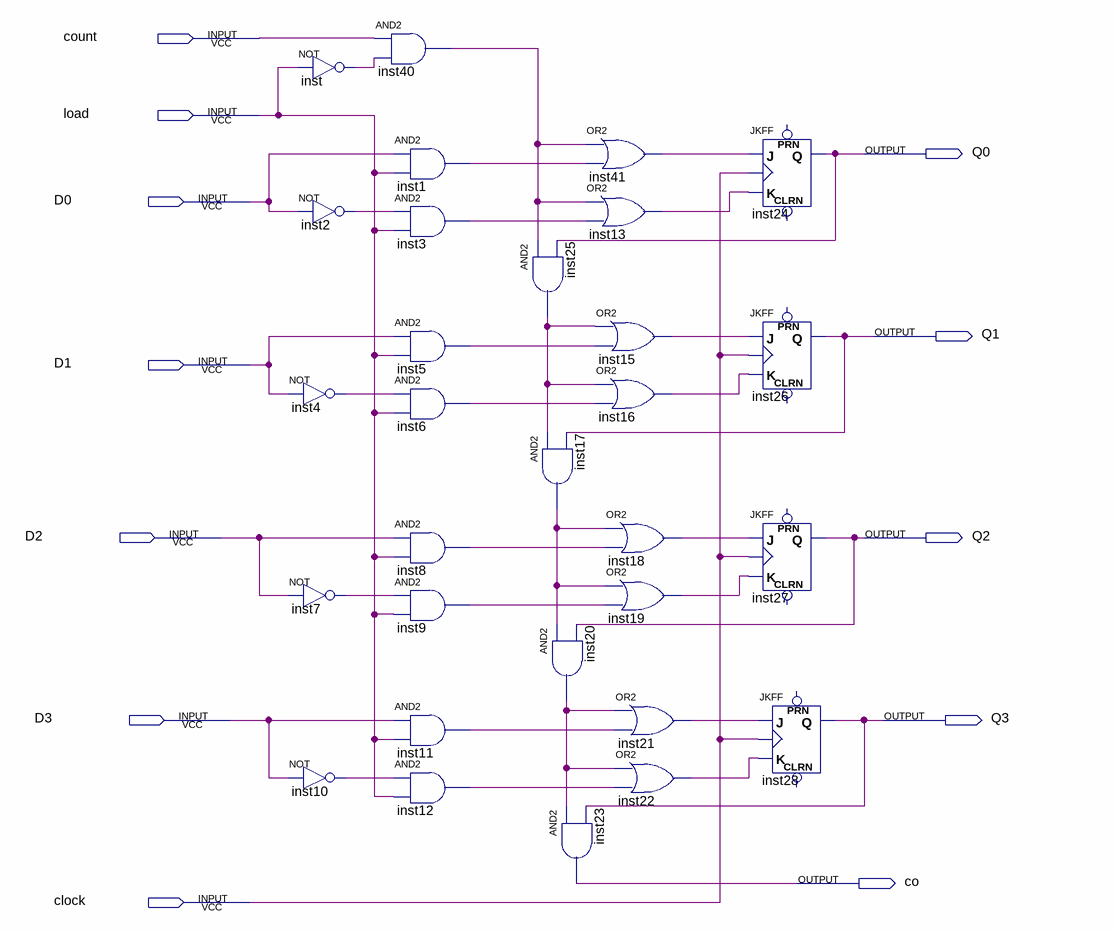
[diagram p0: schematic sheet]
// Quartus schematic yusuf_gassaloglu_2020510034_HW1_a.bdf as structural Verilog: 30 symbols, 12 pins
module yusuf_gassaloglu_2020510034_HW1_a (
  input  count,
  input  load,
  input  D0,
  input  D1,
  input  D2,
  input  D3,
  input  clock,
  output Q0,
  output Q1,
  output Q2,
  output Q3,
  output co
);

  wire inst1_out, inst2_out, inst3_out, inst4_out, inst5_out, inst6_out, inst7_out, inst8_out, inst9_out,
       inst10_out, inst11_out, inst12_out, inst13_out, inst15_out, inst16_out, inst17_out, inst18_out,
       inst19_out, inst20_out, inst21_out, inst22_out, inst25_out, inst40_out, inst41_out, inst_out;

  not inst (inst_out, load);
  not inst2 (inst2_out, D0);
  not inst4 (inst4_out, D1);
  not inst7 (inst7_out, D2);
  not inst10 (inst10_out, D3);
  and inst40 (inst40_out, count, inst_out);
  and inst1 (inst1_out, D0, load);
  and inst3 (inst3_out, inst2_out, load);
  and inst5 (inst5_out, D1, load);
  and inst6 (inst6_out, inst4_out, load);
  and inst8 (inst8_out, D2, load);
  and inst9 (inst9_out, inst7_out, load);
  and inst11 (inst11_out, D3, load);
  and inst12 (inst12_out, inst10_out, load);
  and inst25 (inst25_out, inst40_out, Q0);
  and inst17 (inst17_out, inst25_out, Q1);
  or inst41 (inst41_out, inst40_out, inst1_out);
  or inst13 (inst13_out, inst40_out, inst3_out);
  or inst15 (inst15_out, inst25_out, inst5_out);
  or inst16 (inst16_out, inst25_out, inst6_out);
  or inst18 (inst18_out, inst17_out, inst8_out);
  or inst19 (inst19_out, inst17_out, inst9_out);
  and inst20 (inst20_out, inst17_out, Q2);
  and inst23 (co, inst20_out, Q3);
  or inst21 (inst21_out, inst20_out, inst11_out);
  or inst22 (inst22_out, inst20_out, inst12_out);
  JKFF inst24 (.K(inst13_out), .J(inst41_out), .CLK(clock), .Q(Q0));  // open: PRN, CLRN
  JKFF inst26 (.K(inst16_out), .J(inst15_out), .CLK(clock), .Q(Q1));  // open: PRN, CLRN
  JKFF inst27 (.K(inst19_out), .J(inst18_out), .CLK(clock), .Q(Q2));  // open: PRN, CLRN
  JKFF inst28 (.K(inst22_out), .J(inst21_out), .CLK(clock), .Q(Q3));  // open: PRN, CLRN
endmodule
